# Altium schematic sheet Neopixel.SchDoc
size A4
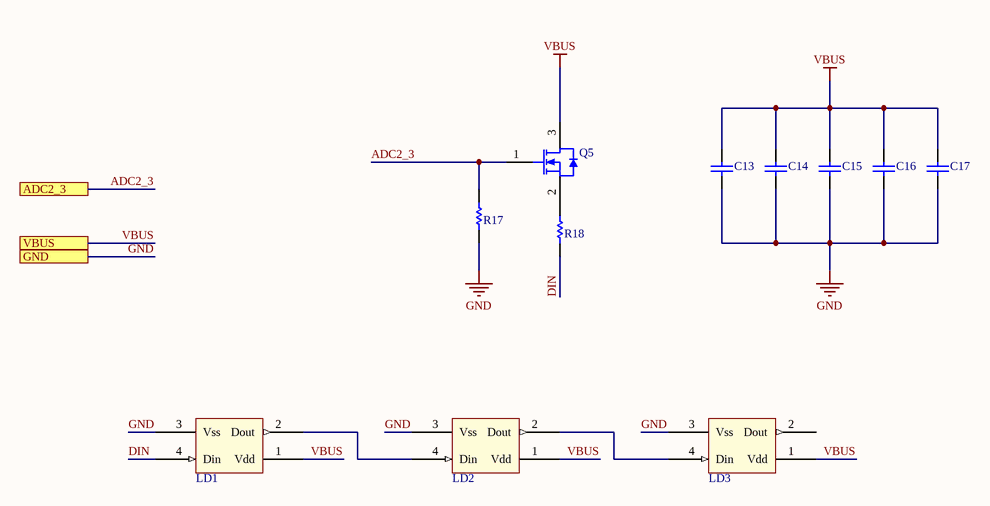
[diagram p0: Neopixel.SchDoc]

## Parts
C13  C0805C105K4RAC7800  [CAPC2013X145X50NL20T25]  (value not drawn)
C14  C0805C105K4RAC7800  [CAPC2013X145X50NL20T25]  (value not drawn)
C15  C0805C105K4RAC7800  [CAPC2013X145X50NL20T25]  (value not drawn)
C16  C0805C105K4RAC7800  [CAPC2013X145X50NL20T25]  (value not drawn)
C17  C0805C105K4RAC7800  [CAPC2013X145X50NL20T25]  (value not drawn)
LD1  WS2812B-B  [WS2812B]  (value not drawn)
LD2  WS2812B-B  [WS2812B]  (value not drawn)
LD3  WS2812B-B  [WS2812B]  (value not drawn)
Q5  BSS138-7-F  [DIOD-SOT23-3_V]  (value not drawn)
R17  RK73B2ATTD103J  [RESC2013X60X30NL20T20]  (value not drawn)
R18  RK73B2ATTD471J  [RESC2013X60X30NL20T20]  (value not drawn)

## Ports
ADC2_3, GND, VBUS

## Nets
GND: C13.1 C14.1 C15.1 C16.1 C17.1 LD1.3(Vss) LD2.3(Vss) LD3.3(Vss) R17.2 ; port GND
VBUS: C13.2 C14.2 C15.2 C16.2 C17.2 LD1.1(Vdd) LD2.1(Vdd) LD3.1(Vdd) Q5.3(D) ; port VBUS
ADC2_3: Q5.1(G) R17.1 ; port ADC2_3
DIN: LD1.4(Din) R18.1
NetLD1_2: LD1.2(Dout) LD2.4(Din)
NetLD2_2: LD2.2(Dout) LD3.4(Din)
NetQ5_2: Q5.2(S) R18.2

Not connected (* = marked no-connect by the designer): LD3 2(Dout)

## Library data of the parts
C13-C17 = CMP-2007-01082-1: 1µF ±10% 16V Ceramic Capacitor X7R 0805 (2012 Metric); Manufacturer: Kemet; Part Number: C0805C105K4RAC7800
LD1-LD3 = WS2812B: Neopixel Led 5050- ws2812b RGB; Manufacture: Worldsemi; Part Number: WS2812B-B
Q5 = CMP-2000-04930-1: N-Channel Enhancement Mode Mosfet, 50 V, 0.2 A, -55 to 150 degC, 3-Pin SOT23, RoHS, Tape and Reel; Manufacturer: Diodes Inc; Brand: DiodesIncorporated; Unit Weight: 0.000282oz; Pd - Power Dissipation: 300mW; Id - Continuous Drain Current: 200mA; Rds On - Drain-Source Resistance: 3.5Ohms; Vgs - Gate-Source Voltage: 20V; Number of Channels: 1Channel; Vds - Drain-Source Breakdown Voltage: 50V; Transistor Type: 1N-Channel; Typical Turn-Off Delay Time: 20ns; Configuration: Single; Mounting Style: SMD/SMT; Height: 1mm; Package Description: 3-Pin Small Outline Transistor, Body 2.9 x 1.3 mm, Pitch 0.96 mm; Datasheet Version: Rev. 20-2, 11/2013; Minimum Operating Temperature: -55C; Package / Case: SOT-23-3; Channel Mode: Enhancement; Product: MOSFETSmallSignal; Packaging: Reel; Maximum Operating Temperature: +150C; Datasheet URL: https://datasheet.ciiva.com/8115/ds30144-8115344.pdf; Product Category: MOSFET; Width: 1.3mm; Technology: Si; Package Reference: SOT23-3; Manufacturer URL: http://www.diodes.com/; Transistor Polarity: N-Channel; Length: 2.9mm; Factory Pack Quantity: 3000; Series: BSS138; RoHS: True; Typical Turn-On Delay Time: 20ns
R17 = CMP-2001-04657-1: 10 kOhms ±5% 0.25W, 1/4W Chip Resistor 0805 (2012 Metric) Automotive AEC-Q200, Moisture Resistant Thick Film; Manufacturer: KOA Speer; Part Number: RK73B2ATTD103J
R18 = CMP-2001-01835-1: 470 Ohms ±5% 0.25W, 1/4W Chip Resistor 0805 (2012 Metric) Automotive AEC-Q200, Moisture Resistant Thick Film; Manufacturer: KOA Speer; Part Number: RK73B2ATTD471J